# Altium project uMultimeter_ExpGPIO.PrjPCB
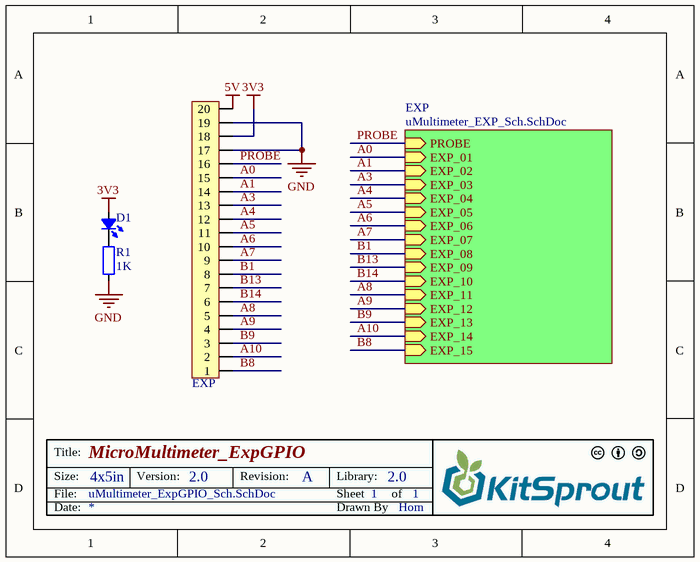
[diagram p0: uMultimeter_ExpGPIO_Sch.SchDoc]
2 sheets, 4 parts. Net scope: hierarchical (ports join the sheet entries above them; power ports are global).
Board file: uMultimeter_ExpGPIO_Pcb.PcbDoc
Sheets:
  uMultimeter_ExpGPIO_Sch.SchDoc
    EXP = uMultimeter_EXP_Sch.SchDoc

## Sheet uMultimeter_ExpGPIO_Sch.SchDoc: MicroMultimeter_ExpGPIO
size 127 x 101 mm; Author: Hom; CompanyName: KitSprout; DrawnBy: Hom; Engineer: Hom; Organization: KitSprout; Revision: A; SheetNumber: 1; SheetTotal: 1; License: CC BY-SA 4.0; Version: 2.0; LibVersion: 2.0; PageSetup: Record=PageOptions|CenterHorizontal=True|CenterVertical=True|PrintScale=1.00|XCorrection=1.00|YCorrection=1.00|PrintKind=0|BorderSize=5000000|LeftOffset=0|BottomOffset=0|Orientation=2|PaperLength=1000|PaperWidth=1000|Scale=100|PaperSource=7|PrintQuality=-3|MediaType=1|DitherType=10|PrintScaleMode=0|PaperKind=A4|PaperIndex=9

### Parts
D1  LED_0805  [LED_0805_BLUE]  (value not drawn)
EXP  HDR1x20_2.54  [HDR1X20_2.54_180H]  (value not drawn)
R1  value 1K  [RES_0603]  (hidden comment: Res_0603)

### Sub-sheets
EXP = uMultimeter_EXP_Sch.SchDoc: PROBE (in), EXP_01 (in), EXP_02 (in), EXP_03 (in), EXP_04 (in), EXP_05 (in), EXP_06 (in), EXP_07 (in), EXP_08 (in), EXP_09 (in), EXP_10 (in), EXP_11 (in), EXP_12 (in), EXP_13 (in), EXP_14 (in), EXP_15 (in)

### Nets
3V3: D1.1(A) EXP.18
5V: EXP.20
GND: EXP.17 EXP.19 R1.2
A0: EXP.15 ; sheet EXP/EXP_01
A1: EXP.14 ; sheet EXP/EXP_02
A3: EXP.13 ; sheet EXP/EXP_03
A4: EXP.12 ; sheet EXP/EXP_04
A5: EXP.11 ; sheet EXP/EXP_05
A6: EXP.10 ; sheet EXP/EXP_06
A7: EXP.9 ; sheet EXP/EXP_07
A8: EXP.5 ; sheet EXP/EXP_11
A9: EXP.4 ; sheet EXP/EXP_12
A10: EXP.2 ; sheet EXP/EXP_14
B1: EXP.8 ; sheet EXP/EXP_08
B8: EXP.1 ; sheet EXP/EXP_15
B9: EXP.3 ; sheet EXP/EXP_13
B13: EXP.7 ; sheet EXP/EXP_09
B14: EXP.6 ; sheet EXP/EXP_10
PROBE: EXP.16 ; sheet EXP/PROBE
NetD1_2: D1.2(K) R1.1

### Notes on the sheet
- Title:
- Size:
- Date:
- File:
- 4x5in
- Version:
- Revision:
- Sheet
- Drawn By
- Library:
- of

### Library data of the parts
D1 = LED_0805: LED
EXP = HDR1x20_2.54: Header
R1 = Res_0603: Resistor

## Sheet uMultimeter_EXP_Sch.SchDoc: MicroMultimeter - EXP
size 127 x 101 mm; Author: Hom; CompanyName: KitSprout; DrawnBy: Hom; Engineer: Hom; Organization: KitSprout; Revision: A; SheetNumber: 1; SheetTotal: 1; License: CC BY-SA 4.0; Version: 2.0; LibVersion: 2.0; PageSetup: Record=PageOptions|CenterHorizontal=True|CenterVertical=True|PrintScale=1.00|XCorrection=1.00|YCorrection=1.00|PrintKind=0|BorderSize=5000000|LeftOffset=0|BottomOffset=0|Orientation=2|PaperLength=1000|PaperWidth=1000|Scale=100|PaperSource=7|PrintQuality=-3|MediaType=1|DitherType=10|PrintScaleMode=0|PaperKind=A4|PaperIndex=9
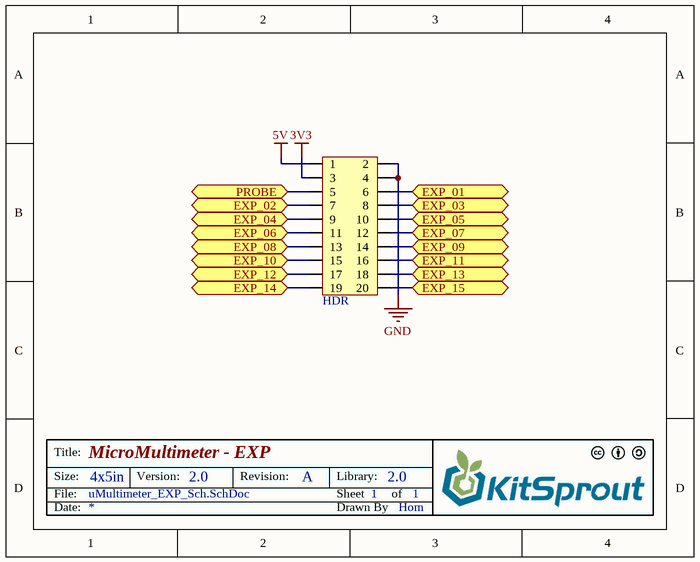
[diagram p1: uMultimeter_EXP_Sch.SchDoc]

### Parts
HDR  HDR2x10_2.54  [HDR2X10_2.54_180H]  (value not drawn)

### Ports
EXP_01, EXP_02, EXP_03, EXP_04, EXP_05, EXP_06, EXP_07, EXP_08, EXP_09, EXP_10, EXP_11, EXP_12, EXP_13, EXP_14, EXP_15, PROBE

### Nets
3V3: HDR.3
5V: HDR.1
GND: HDR.2 HDR.4
A0: HDR.6 ; port EXP_01
A1: HDR.7 ; port EXP_02
A3: HDR.8 ; port EXP_03
A4: HDR.9 ; port EXP_04
A5: HDR.10 ; port EXP_05
A6: HDR.11 ; port EXP_06
A7: HDR.12 ; port EXP_07
A8: HDR.16 ; port EXP_11
A9: HDR.17 ; port EXP_12
A10: HDR.19 ; port EXP_14
B1: HDR.13 ; port EXP_08
B8: HDR.20 ; port EXP_15
B9: HDR.18 ; port EXP_13
B13: HDR.14 ; port EXP_09
B14: HDR.15 ; port EXP_10
PROBE: HDR.5 ; port PROBE

### Notes on the sheet
- Title:
- Size:
- Date:
- File:
- 4x5in
- Version:
- Revision:
- Sheet
- Drawn By
- Library:
- of

### Library data of the parts
HDR = HDR2x10_2.54: Header

## Nets that join several sheets
3V3: uMultimeter_ExpGPIO_Sch (D1.1 EXP.18), uMultimeter_EXP_Sch (HDR.3)
5V: uMultimeter_ExpGPIO_Sch (EXP.20), uMultimeter_EXP_Sch (HDR.1)
GND: uMultimeter_ExpGPIO_Sch (EXP.17 EXP.19 R1.2), uMultimeter_EXP_Sch (HDR.2 HDR.4)
A0: uMultimeter_ExpGPIO_Sch (EXP.15), uMultimeter_EXP_Sch (HDR.6)
A1: uMultimeter_ExpGPIO_Sch (EXP.14), uMultimeter_EXP_Sch (HDR.7)
A3: uMultimeter_ExpGPIO_Sch (EXP.13), uMultimeter_EXP_Sch (HDR.8)
A4: uMultimeter_ExpGPIO_Sch (EXP.12), uMultimeter_EXP_Sch (HDR.9)
A5: uMultimeter_ExpGPIO_Sch (EXP.11), uMultimeter_EXP_Sch (HDR.10)
A6: uMultimeter_ExpGPIO_Sch (EXP.10), uMultimeter_EXP_Sch (HDR.11)
A7: uMultimeter_ExpGPIO_Sch (EXP.9), uMultimeter_EXP_Sch (HDR.12)
A8: uMultimeter_ExpGPIO_Sch (EXP.5), uMultimeter_EXP_Sch (HDR.16)
A9: uMultimeter_ExpGPIO_Sch (EXP.4), uMultimeter_EXP_Sch (HDR.17)
A10: uMultimeter_ExpGPIO_Sch (EXP.2), uMultimeter_EXP_Sch (HDR.19)
B1: uMultimeter_ExpGPIO_Sch (EXP.8), uMultimeter_EXP_Sch (HDR.13)
B8: uMultimeter_ExpGPIO_Sch (EXP.1), uMultimeter_EXP_Sch (HDR.20)
B9: uMultimeter_ExpGPIO_Sch (EXP.3), uMultimeter_EXP_Sch (HDR.18)
B13: uMultimeter_ExpGPIO_Sch (EXP.7), uMultimeter_EXP_Sch (HDR.14)
B14: uMultimeter_ExpGPIO_Sch (EXP.6), uMultimeter_EXP_Sch (HDR.15)
PROBE: uMultimeter_ExpGPIO_Sch (EXP.16), uMultimeter_EXP_Sch (HDR.5)